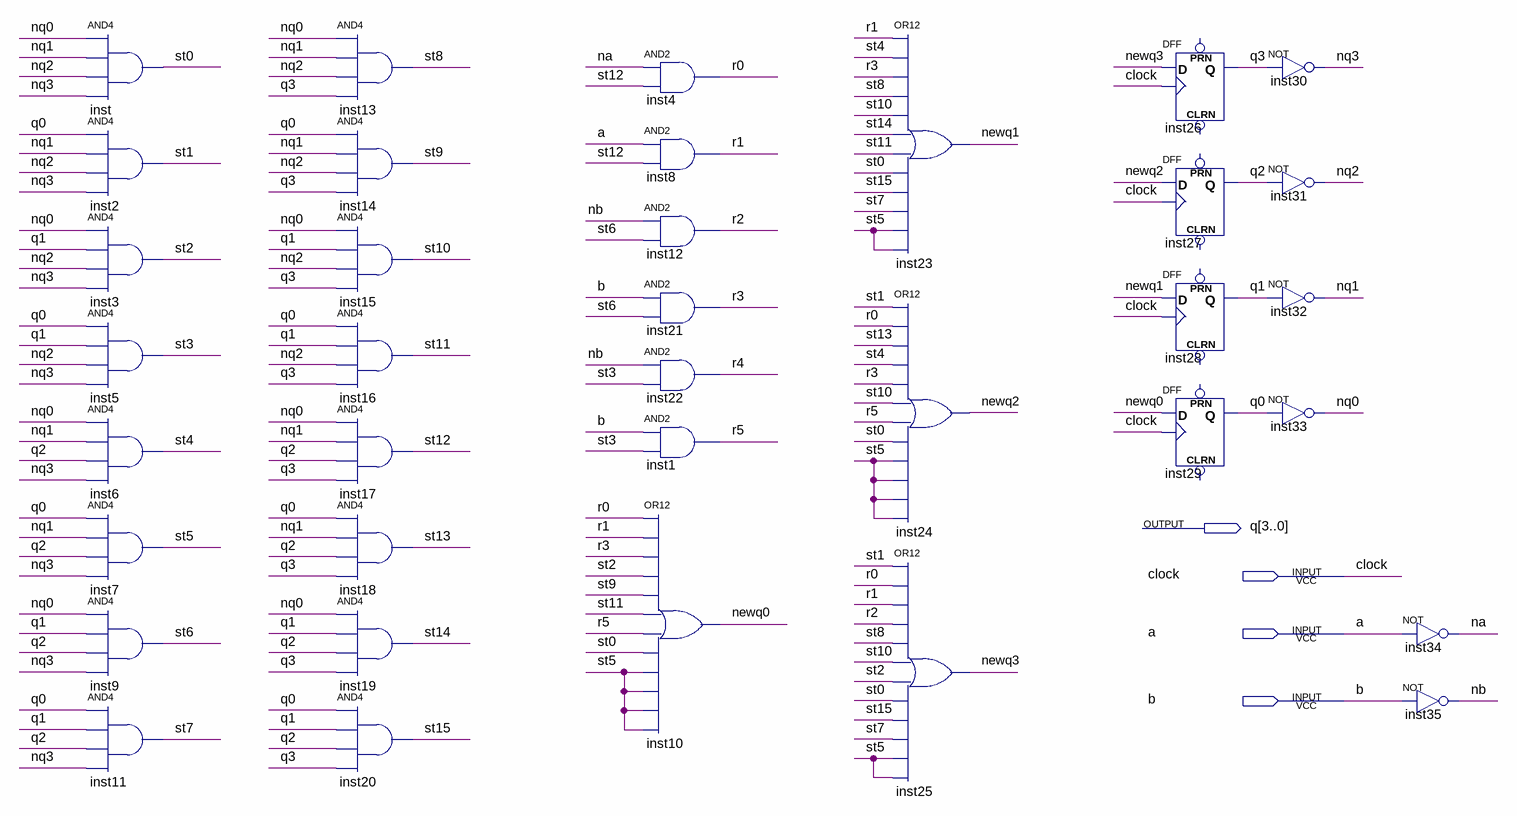
[diagram p0: schematic sheet]
// Quartus schematic LAB_4_v21.bdf as structural Verilog: 36 symbols, 4 pins
module LAB_4_v21 (
  input  clock,
  input  a,
  input  b,
  output [3:0] q
);

  wire na, nb, newq0, newq1, newq2, newq3, nq0, nq1, nq2, nq3, r0, r1, r2, r3, r4, r5, st0, st1, st2, st3,
       st4, st5, st6, st7, st8, st9, st10, st11, st12, st13, st14, st15;

  and inst (st0, nq0, nq1, nq2, nq3);
  and inst2 (st1, q[0], nq1, nq2, nq3);
  and inst3 (st2, nq0, q[1], nq2, nq3);
  and inst5 (st3, q[0], q[1], nq2, nq3);
  and inst6 (st4, nq0, nq1, q[2], nq3);
  and inst7 (st5, q[0], nq1, q[2], nq3);
  and inst9 (st6, nq0, q[1], q[2], nq3);
  and inst11 (st7, q[0], q[1], q[2], nq3);
  and inst13 (st8, nq0, nq1, nq2, q[3]);
  and inst14 (st9, q[0], nq1, nq2, q[3]);
  and inst15 (st10, nq0, q[1], nq2, q[3]);
  and inst16 (st11, q[0], q[1], nq2, q[3]);
  and inst17 (st12, nq0, nq1, q[2], q[3]);
  and inst18 (st13, q[0], nq1, q[2], q[3]);
  and inst19 (st14, nq0, q[1], q[2], q[3]);
  and inst20 (st15, q[0], q[1], q[2], q[3]);
  and inst4 (r0, na, st12);
  and inst8 (r1, a, st12);
  and inst12 (r2, nb, st6);
  and inst21 (r3, b, st6);
  and inst22 (r4, nb, st3);
  and inst1 (r5, b, st3);
  or inst10 (newq0, r0, r1, r3, st2, st9, st11, r5, st0, st5, st5, st5, st5);
  or inst23 (newq1, r1, st4, r3, st8, st10, st14, st11, st0, st15, st7, st5, st5);
  or inst24 (newq2, st1, r0, st13, st4, r3, st10, r5, st0, st5, st5, st5, st5);
  or inst25 (newq3, st1, r0, r1, r2, st8, st10, st2, st0, st15, st7, st5, st5);
  DFF inst26 (.CLK(clock), .D(newq3), .Q(q[3]));  // open: CLRN, PRN
  DFF inst27 (.CLK(clock), .D(newq2), .Q(q[2]));  // open: CLRN, PRN
  DFF inst28 (.CLK(clock), .D(newq1), .Q(q[1]));  // open: CLRN, PRN
  DFF inst29 (.CLK(clock), .D(newq0), .Q(q[0]));  // open: CLRN, PRN
  not inst30 (nq3, q[3]);
  not inst31 (nq2, q[2]);
  not inst32 (nq1, q[1]);
  not inst33 (nq0, q[0]);
  not inst34 (na, a);
  not inst35 (nb, b);
endmodule
